# Altium schematic sheet analog_clock_gen.SchDoc
size A4
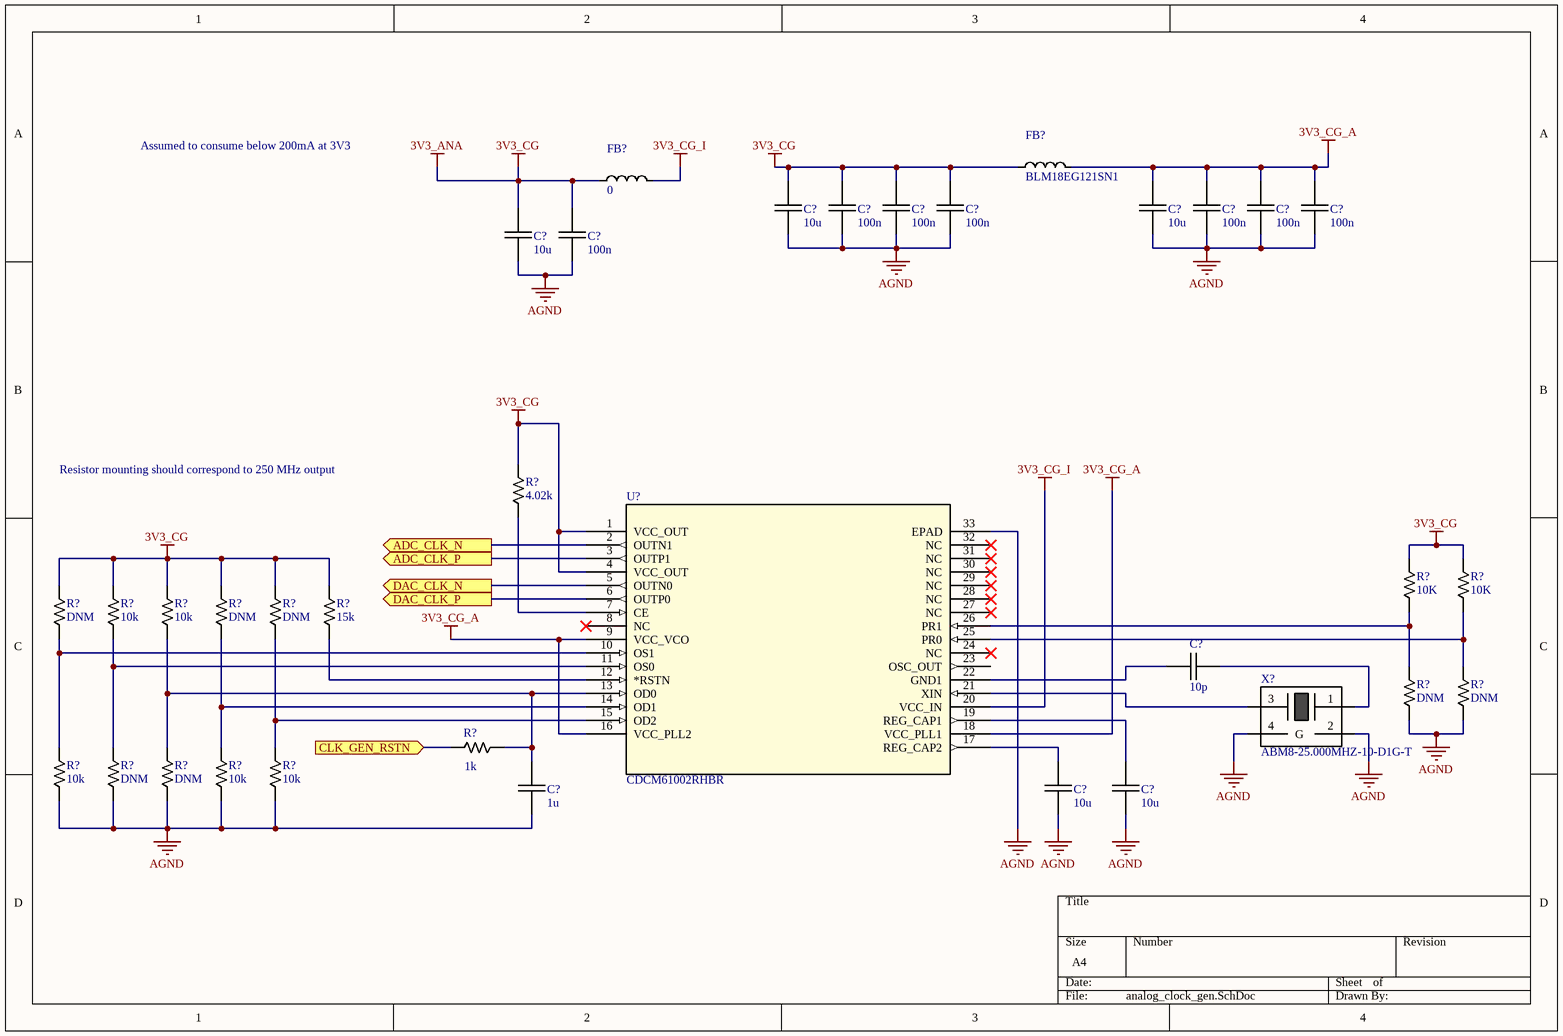
[diagram p0: analog_clock_gen.SchDoc]

## Parts
(Parts that share a designator on the sheet are numbered #1, #2 ... from top to bottom, then left to right.)
C?#1  value 10u  [CAPC1608X09N]  (hidden comment: MLLC Capacitor)
C?#2  value 100n  [CAPC1005X06N]  (hidden comment: MLLC Capacitor)
C?#3  value 100n  [CAPC1005X06N]  (hidden comment: MLLC Capacitor)
C?#4  value 100n  [CAPC1005X06N]  (hidden comment: MLLC Capacitor)
C?#5  value 10u  [CAPC1608X09N]  (hidden comment: MLLC Capacitor)
C?#6  value 100n  [CAPC1005X06N]  (hidden comment: MLLC Capacitor)
C?#7  value 100n  [CAPC1005X06N]  (hidden comment: MLLC Capacitor)
C?#8  value 100n  [CAPC1005X06N]  (hidden comment: MLLC Capacitor)
C?#9  value 10u  [CAPC1608X09N]  (hidden comment: MLLC Capacitor)
C?#10  value 100n  [CAPC1005X06N]  (hidden comment: MLLC Capacitor)
C?#11  value 10p  [CAPC1005X06N]  (hidden comment: MLLC Capacitor)
C?#12  value 1u  [CAPC1005X06N]  (hidden comment: MLLC Capacitor)
C?#13  value 10u  [CAPC1608X09N]  (hidden comment: MLLC Capacitor)
C?#14  value 10u  [CAPC1608X09N]  (hidden comment: MLLC Capacitor)
FB?#1  value BLM18EG121SN1  [INDC1608X08N]  (hidden comment: Chip Inductor)
FB?#2  value 0  [INDC1608X08N]  (hidden comment: Chip Inductor)
R?#1  value 4.02k  [RESC3216X06N]  (hidden comment: Chip Resistor)
R?#2  value 10K  [RESC3216X06N]  (hidden comment: Chip Resistor)
R?#3  value 10K  [RESC3216X06N]  (hidden comment: Chip Resistor)
R?#4  value DNM  [RESC3216X06N]  (hidden comment: Chip Resistor)
R?#5  value 10k  [RESC3216X06N]  (hidden comment: Chip Resistor)
R?#6  value 10k  [RESC3216X06N]  (hidden comment: Chip Resistor)
R?#7  value DNM  [RESC3216X06N]  (hidden comment: Chip Resistor)
R?#8  value DNM  [RESC3216X06N]  (hidden comment: Chip Resistor)
R?#9  value 15k  [RESC3216X06N]  (hidden comment: Chip Resistor)
R?#10  value DNM  [RESC3216X06N]  (hidden comment: Chip Resistor)
R?#11  value DNM  [RESC3216X06N]  (hidden comment: Chip Resistor)
R?#12  value 1k  [RESC3216X06N]  (hidden comment: Chip Resistor)
R?#13  value 10k  [RESC3216X06N]  (hidden comment: Chip Resistor)
R?#14  value DNM  [RESC3216X06N]  (hidden comment: Chip Resistor)
R?#15  value DNM  [RESC3216X06N]  (hidden comment: Chip Resistor)
R?#16  value 10k  [RESC3216X06N]  (hidden comment: Chip Resistor)
R?#17  value 10k  [RESC3216X06N]  (hidden comment: Chip Resistor)
U?  CDCM61002RHBR  [RHB32_3P45X3P45]
X?  ABM8-25.000MHZ-10-D1G-T  [ABM8_3P20X2P5]

## Ports
ADC_CLK_N (out), ADC_CLK_P (out), CLK_GEN_RSTN (in), DAC_CLK_N (out), DAC_CLK_P (out)

## Nets
3V3_ANA: C?#1.2 C?#2.2 C?#3.2 C?#4.2 C?#9.2 C?#10.2 FB?#1.1 FB?#2.1 R?#1.2 R?#2.2 R?#3.2 R?#4.2 R?#5.2 R?#6.2 R?#7.2 R?#8.2 R?#9.2 U?.1(VCC_OUT) U?.4(VCC_OUT)  [also labelled 3V3_CG]
3V3_CG_A: C?#5.2 C?#6.2 C?#7.2 C?#8.2 FB?#1.2 U?.9(VCC_VCO) U?.16(VCC_PLL2) U?.18(VCC_PLL1)
3V3_CG_I: FB?#2.2 U?.20(VCC_IN)
AGND: C?#1.1 C?#2.1 C?#3.1 C?#4.1 C?#5.1 C?#6.1 C?#7.1 C?#8.1 C?#9.1 C?#10.1 C?#12.1 C?#13.1 C?#14.1 R?#10.1 R?#11.1 R?#13.1 R?#14.1 R?#15.1 R?#16.1 R?#17.1 U?.33(EPAD) X?.2 X?.4(G)
ADC_CLK_N: U?.2(OUTN1) ; port ADC_CLK_N
ADC_CLK_P: U?.3(OUTP1) ; port ADC_CLK_P
CLK_GEN_RSTN: R?#12.2 ; port CLK_GEN_RSTN
DAC_CLK_N: U?.5(OUTN0) ; port DAC_CLK_N
DAC_CLK_P: U?.6(OUTP0) ; port DAC_CLK_P
NetC?#11_1: C?#11.1 X?.1
NetC?#11_2: C?#11.2 U?.22(GND1)
NetC?#12_2: C?#12.2 R?#6.1 R?#12.1 R?#15.2 U?.13(OD0)
NetC?#13_2: C?#13.2 U?.17(REG_CAP2)
NetC?#14_2: C?#14.2 U?.19(REG_CAP1)
NetR?#1_1: R?#1.1 U?.7(CE)
NetR?#2_1: R?#2.1 R?#10.2 U?.26(PR1)
NetR?#3_1: R?#3.1 R?#11.2 U?.25(PR0)
NetR?#4_1: R?#4.1 R?#13.2 U?.10(OS1)
NetR?#5_1: R?#5.1 R?#14.2 U?.11(OS0)
NetR?#7_1: R?#7.1 R?#16.2 U?.14(OD1)
NetR?#8_1: R?#8.1 R?#17.2 U?.15(OD2)
NetR?#9_1: R?#9.1 U?.12(*RSTN)
NetU?_21: U?.21(XIN) X?.3

Not connected (* = marked no-connect by the designer): U? 8(NC)* 23(OSC_OUT) 24(NC)* 27(NC)* 28(NC)* 29(NC)* 30(NC)* 31(NC)* 32(NC)*

## Notes on the sheet
- Assumed to consume below 200mA at 3V3
- Resistor mounting should correspond to 250 MHz output

## Library data of the parts
C?#1-C?#14 = Cap: Rating: *
FB?#1 FB?#2 = Ind
R?#1-R?#17 = Res
U? = CDCM61002RHBR: 1:2 Ultra Low Jitter Crystal-In Clock Generator; Manufacturer: Texas Instruments; INDUSTRY_STD_PKG_TYPE: QFN; FAMILY_NAME: INTERNAL VCO OUTPUT; PIN_COUNT: 32; PACKAGE_DESIGNATOR: RHB; Datasheet_URL: http://www.ti.com/lit/gpn/CDCM61002; GENERIC_PART_NUMBER: CDCM61002; Copyright: Copyright (C) 2018 Accelerated Designs. All rights reserved; RefDes: RefDes; Type: DEV; ComponentLink1Description: Product Page; ComponentLink1URL: https://www.ti.com/product/CDCM61002
X? = ABM8-25.000MHZ: 25MHz ±10ppm Crystal 10pF 50 Ohms 4-SMD, No Lead